# EAGLE schematic BMSafeMasterV2 (EAGLE 6.3)
DATABASE: ./BOM/BMSafeMasterV2-PARTSDB.txt

## Sheet 1 of 6: POWER SUPPLY
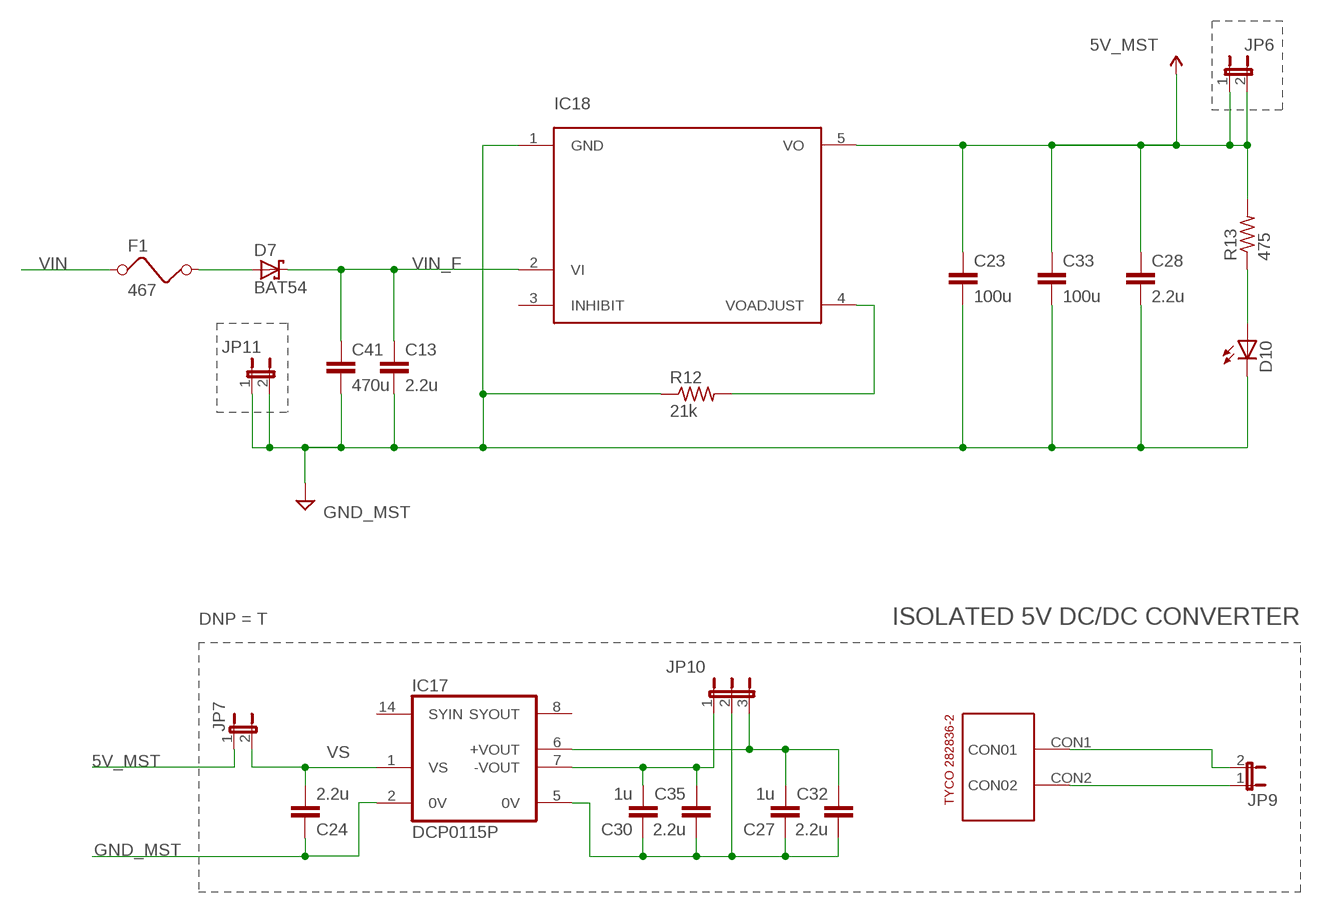
[diagram p0: schematic, sheet 1]

### Parts
C13  2.2u  C-EUC1210  [C1210]
C23  100u  P12924  [EEU-FM1E101]
C24  2.2u  C-EUC1210  [C1210]
C27  1u  C-EU050-024X044  [C050-024X044]
C28  2.2u  C-EUC1210  [C1210]
C30  1u  C-EU050-024X044  [C050-024X044]
C32  2.2u  C-EUC1210  [C1210]
C33  100u  P12924  [EEU-FM1E101]
C35  2.2u  C-EUC1210  [C1210]
C41  470u  P12924  [EEU-FM1E101]
D7  BAT54  [SOT23]
D10  LEDSMT1206  [1206]
F1  467  [0603]
IC17  DCP0115P  [DIL14/7]
IC18  DCDCMAITRE_HOLES  [DCDCMAITRE_HOLES]
JP6  JP1E  [JP1]
JP7  JP1E  [JP1]
JP9  JP1E  [JP1]
JP10  JP2E  [JP2]
JP11  JP1E  [JP1]
R12  21k  R-US_R0805  [R0805]
R13  475  R-US_R0805  [R0805]
X8  282836-2  [282836-2]

### Nets
5V_MST: C23.1 C28.1 C33.1 IC18.5(VO) JP6.1 JP6.2 JP7.1 R13.2 ; supply symbol labelled 5V ; also sheet 2,3,4,5,6
+5V_ISO: C27.2 C32.1 IC17.6(+VOUT) JP10.3
-5V_ISO: C30.2 C35.1 IC17.7(-VOUT) JP10.1
GND_MST: C13.2 C23.2 C24.1 C28.2 C33.2 C41.2 D10.C IC17.2(0V) IC18.1(GND) JP11.1 JP11.2 R12.1 ; supply symbol labelled GND ; also sheet 2,3,4,5,6
HV_GND: C27.1 C30.1 C32.2 C35.2 IC17.5(0V) JP10.2
N$8: D10.A R13.1
N$12: JP9.2 X8.CON1(CON01)
N$13: JP9.1 X8.CON2(CON02)
N$47: D7.1(A) F1.2
VIN: F1.1 ; also sheet 5
VIN_F: C13.1 C41.1 D7.3(C) IC18.2(VI)
VOADJUST: IC18.4(VOADJUST) R12.2
VS: C24.2 IC17.1(VS) JP7.2
Unconnected: IC17.8(SYOUT) IC17.14(SYIN) IC18.3(INHIBIT)

### Notes on the sheet
- IC18
- ISOLATED 5V DC/DC CONVERTER

## Sheet 2 of 6: MICROCONTROLLER
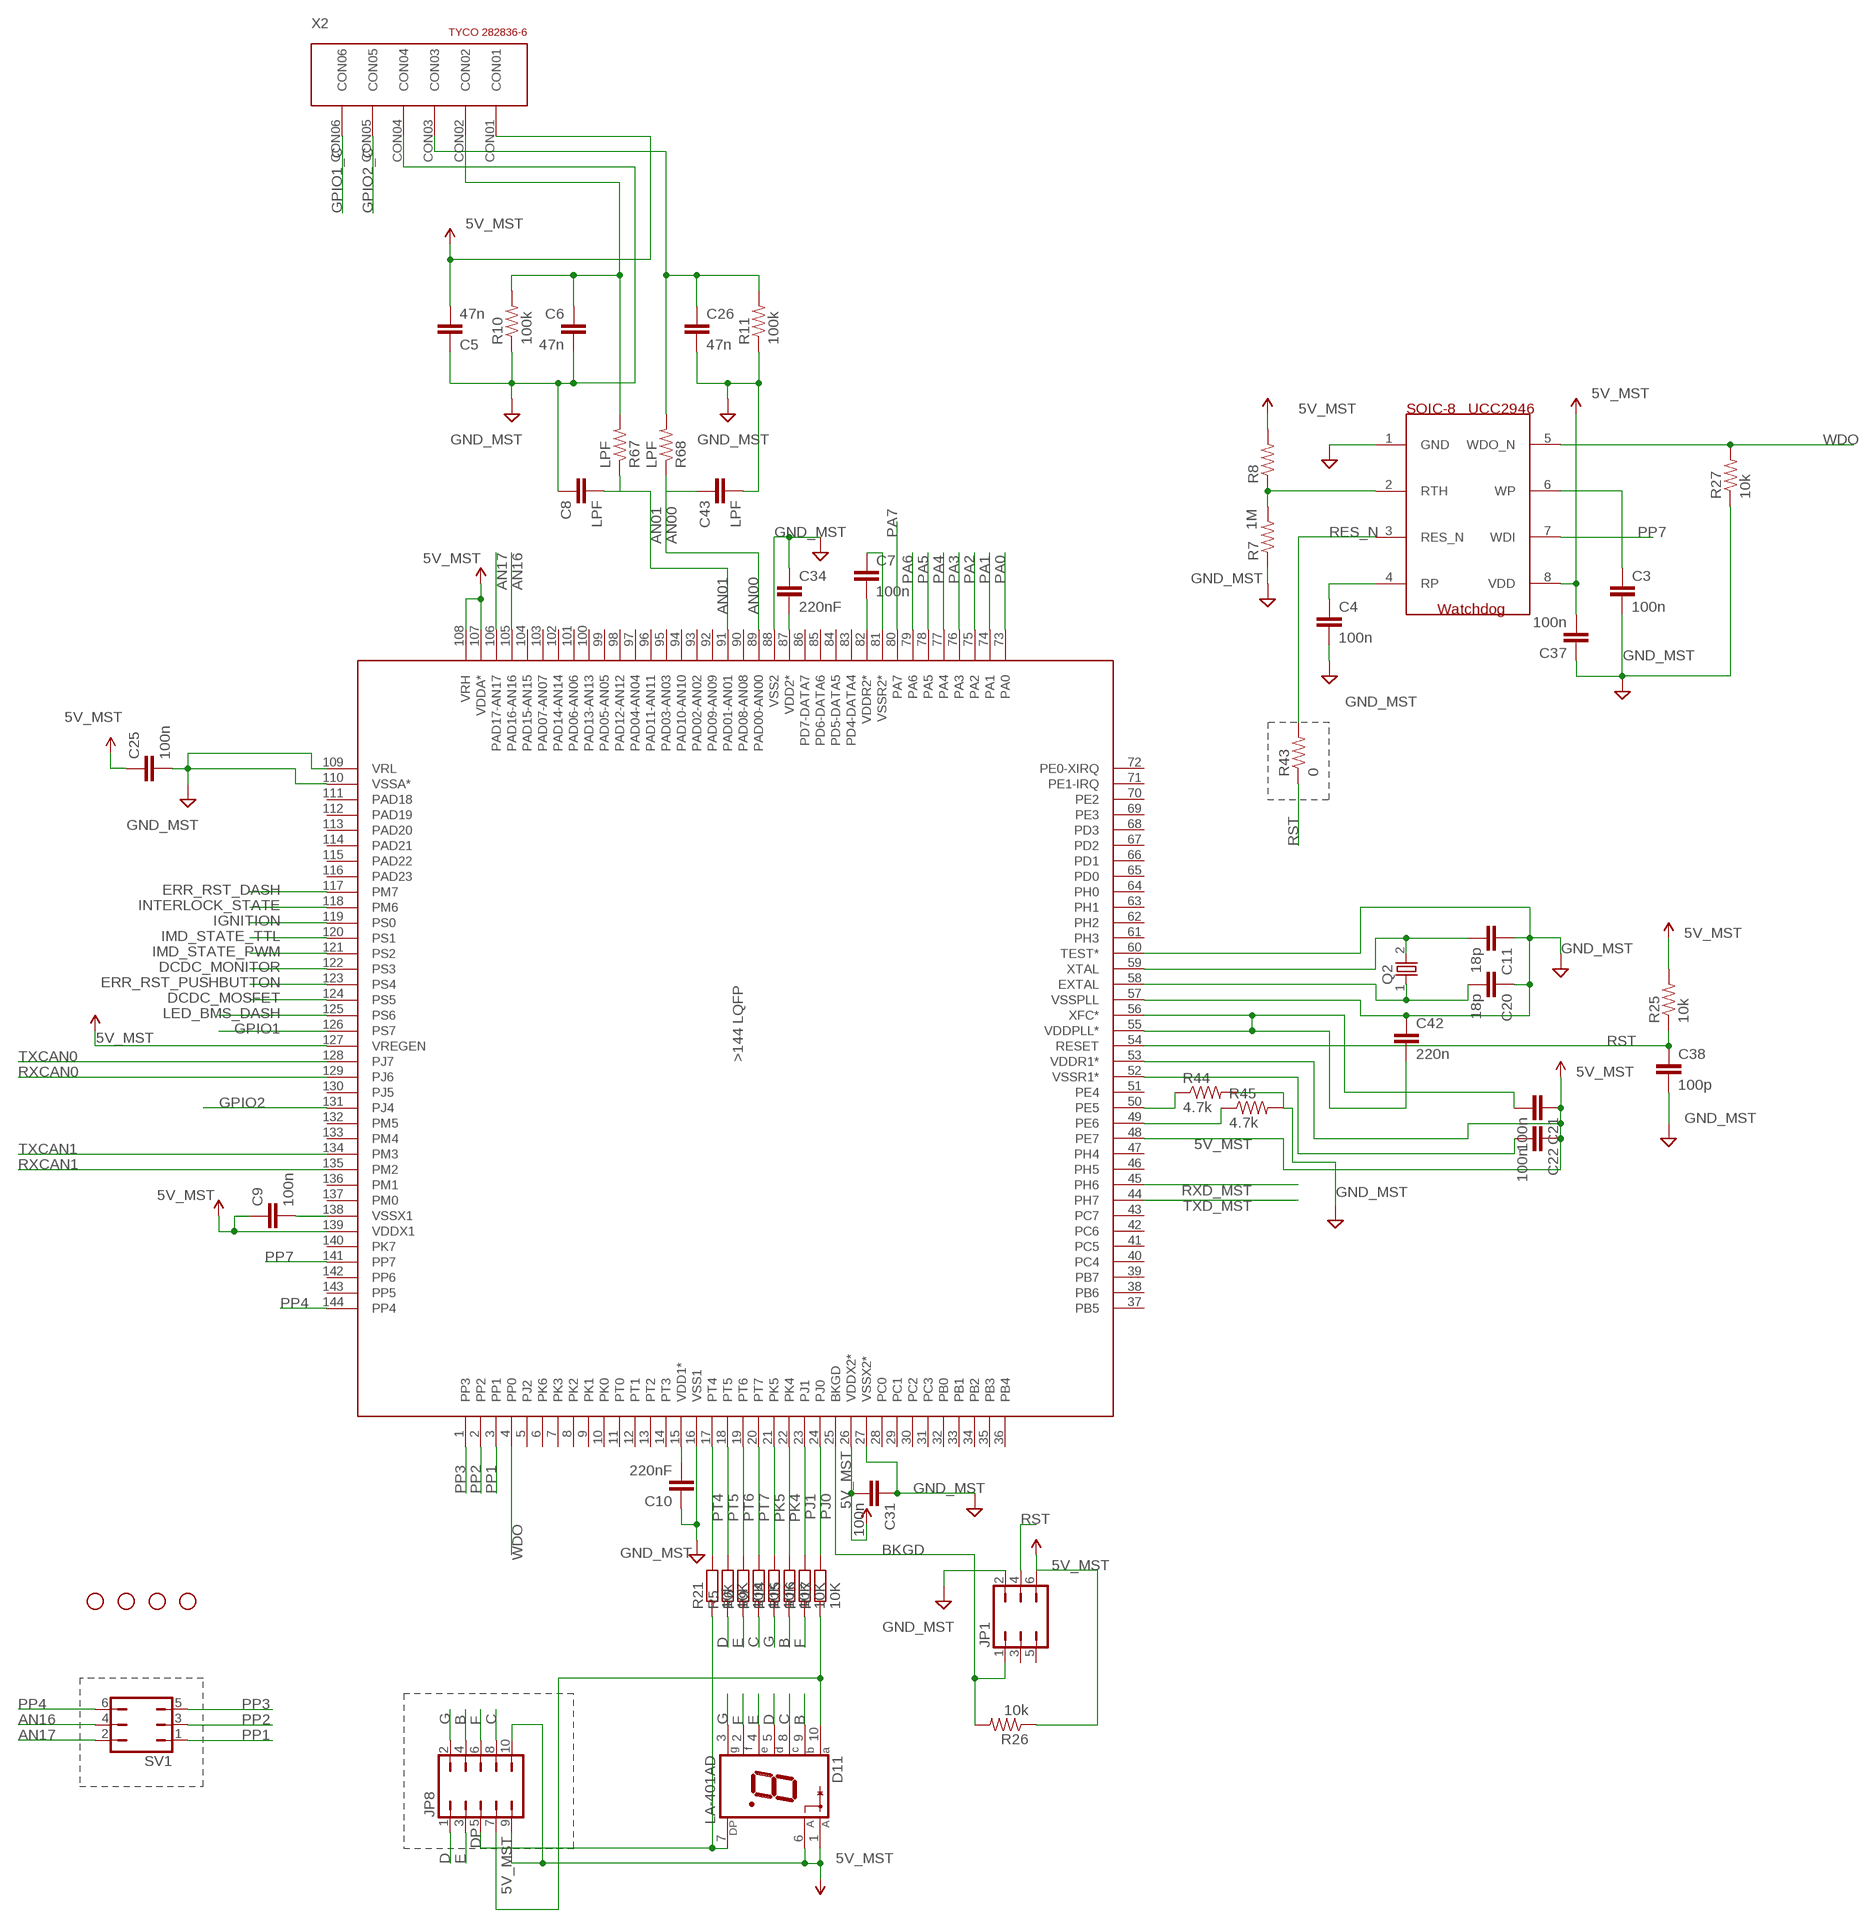
[diagram p1: schematic, sheet 2]

### Parts
C3  100n  C-EUC0805  [C0805]
C4  100n  C-EUC0805  [C0805]
C5  47n  C-EUC0805  [C0805]
C6  47n  C-EUC0805  [C0805]
C7  100n  C-EUC0805  [C0805]
C8  LPF  C-EUC0805  [C0805]
C9  100n  C-EUC0805  [C0805]
C10  220nF  C-EUC0805  [C0805]
C11  18p  C-EUC0805  [C0805]
C20  18p  C-EUC0805  [C0805]
C21  100n  C-EUC0805  [C0805]
C22  100n  C-EUC0805  [C0805]
C25  100n  C-EUC0805  [C0805]
C26  47n  C-EUC0805  [C0805]
C31  100n  C-EUC0805  [C0805]
C34  220nF  C-EUC0805  [C0805]
C37  100n  C-EUC0805  [C0805]
C38  100p  C-EUC0805  [C0805]
C42  220n  C-EUC0805  [C0805]
C43  LPF  C-EUC0805  [C0805]
D11  LA-401AD  [LA-401]
IC1  MC9S12XF-144  [SQFP-S-20X20-144]
IC14  WATCHDOG  [SOIC08]
JP1  JP3Q  [JP3Q]
JP2  STAND-OFF  [STAND-OFF]
JP3  STAND-OFF  [STAND-OFF]
JP4  STAND-OFF  [STAND-OFF]
JP5  STAND-OFF  [STAND-OFF]
JP8  JP5Q  [JP5Q]
Q2  CSM-7X  [CSM-7X]
R5  10K  R-EU_R0805  [R0805]
R6  10K  R-EU_R0805  [R0805]
R7  1M  R-US_R0805  [R0805]
R8  1M  R-US_R0805  [R0805]
R9  10K  R-EU_R0805  [R0805]
R10  100k  R-US_R0805  [R0805]
R11  100k  R-US_R0805  [R0805]
R14  10K  R-EU_R0805  [R0805]
R15  10K  R-EU_R0805  [R0805]
R16  10K  R-EU_R0805  [R0805]
R17  10K  R-EU_R0805  [R0805]
R21  10k  R-EU_R0805  [R0805]
R25  10k  R-US_R0805  [R0805]
R26  10k  R-US_R0805  [R0805]
R27  10k  R-US_R0805  [R0805]
R43  0  R-US_R0805  [R0805]
R44  4.7k  R-US_R0805  [R0805]
R45  4.7k  R-US_R0805  [R0805]
R67  LPF  R-US_R0805  [R0805]
R68  LPF  R-US_R0805  [R0805]
SV1  JP3Q  [JP3Q]
X2  282836-6  [282836-6]

### Nets
5V_MST: C5.2 C7.2 C9.1 C21.1 C22.1 C25.1 C31.2 C37.2 D11.1(A) D11.6(A) IC1.26(VDDX2*) IC1.48(PE7) IC1.53(VDDR1*) IC1.82(VDDR2*) IC1.107(VDDA*) IC1.108(VRH) IC1.127(VREGEN) IC1.139(VDDX1) IC14.8(VDD) JP1.6 JP8.9 JP8.10 R8.2 R25.2 R26.1 X2.CON01 ; supply symbol labelled 5V, 5V_mst ; also sheet 1,3,4,5,6
AN00: C43.1 IC1.89(PAD00-AN00) R68.1
AN00_C: C26.1 R11.2 R68.2 X2.CON03
AN01: C8.2 IC1.91(PAD01-AN01) R67.1
AN01_C: C6.1 R10.2 R67.2 X2.CON02
AN16: IC1.105(PAD16-AN16) SV1.4
AN17: IC1.106(PAD17-AN17) SV1.2
B: D11.9(B) JP8.4 R15.1
BKGD: IC1.25(BKGD) JP1.1 R26.2
C: D11.8(C) JP8.8 R9.1
D: D11.5(D) JP8.1 R5.1
DCDC_MONITOR: IC1.122(PS3) ; also sheet 4
DCDC_MOSFET: IC1.124(PS5) ; also sheet 4
DP: D11.7(DP) JP8.5 R21.1
E: D11.4(E) JP8.3 R6.1
ERR_RST_DASH: IC1.117(PM7) ; also sheet 4
ERR_RST_PUSHBUTTON: IC1.123(PS4) ; also sheet 4
EXTAL: C20.2 IC1.58(EXTAL) Q2.1
F: D11.2(F) JP8.6 R16.1
G: D11.3(G) JP8.2 R14.1
GND_MST: C3.2 C4.2 C5.1 C6.2 C7.1 C8.1 C9.2 C10.1 C11.1 C20.1 C22.2 C25.2 C26.2 C31.1 C34.1 C37.1 C38.2 C42.1 C43.2 IC1.16(VSS1) IC1.27(VSSX2*) IC1.52(VSSR1*) IC1.57(VSSPLL) IC1.60(TEST*) IC1.81(VSSR2*) IC1.88(VSS2) IC1.109(VRL) IC1.110(VSSA*) IC1.138(VSSX1) IC14.1(GND) JP1.2 R7.1 R10.1 R11.1 R27.1 R44.2 R45.2 X2.CON04 ; supply symbol labelled GND ; also sheet 1,3,4,5,6
GPIO1: IC1.126(PS7) ; also sheet 4
GPIO1_C: X2.CON06 ; also sheet 4
GPIO2: IC1.131(PJ4) ; also sheet 4
GPIO2_C: X2.CON05 ; also sheet 4
IGNITION: IC1.119(PS0) ; also sheet 4
IMD_STATE_PWM: IC1.121(PS2) ; also sheet 4
IMD_STATE_TTL: IC1.120(PS1) ; also sheet 4
INTERLOCK_STATE: IC1.118(PM6) ; also sheet 4
LED_BMS_DASH: IC1.125(PS6) ; also sheet 4
N$2: IC14.2(RTH) R7.2 R8.1
N$3: D11.10(A) JP8.7 R17.1
N$5: C4.1 IC14.4(RP)
N$7: C3.1 IC14.6(WP)
N$45: IC1.50(PE5) R44.1
N$46: IC1.49(PE6) R45.1
PA0: IC1.73(PA0) ; also sheet 5
PA1: IC1.74(PA1) ; also sheet 5
PA2: IC1.75(PA2) ; also sheet 5
PA3: IC1.76(PA3) ; also sheet 5
PA4: IC1.77(PA4) ; also sheet 5
PA5: IC1.78(PA5) ; also sheet 5
PA6: IC1.79(PA6)
PA7: IC1.80(PA7)
PJ0: IC1.24(PJ0) R17.2
PJ1: IC1.23(PJ1) R16.2
PK4: IC1.22(PK4) R15.2
PK5: IC1.21(PK5) R14.2
PP1: IC1.3(PP1) SV1.1
PP2: IC1.2(PP2) SV1.3
PP3: IC1.1(PP3) SV1.5
PP4: IC1.144(PP4) SV1.6
PP7: IC1.141(PP7) IC14.7(WDI)
PT4: IC1.17(PT4) R21.2
PT5: IC1.18(PT5) R5.2
PT6: IC1.19(PT6) R6.2
PT7: IC1.20(PT7) R9.2
RES_N: IC14.3(RES_N) R43.2
RST: C38.1 IC1.54(RESET) JP1.4 R25.1 R43.1
RXCAN0: IC1.129(PJ6) ; also sheet 3
RXCAN1: IC1.135(PM2) ; also sheet 3
RXD_MST: IC1.45(PH6) ; also sheet 6
TXCAN0: IC1.128(PJ7) ; also sheet 3
TXCAN1: IC1.134(PM3) ; also sheet 3
TXD_MST: IC1.44(PH7) ; also sheet 6
VDD: C34.2 IC1.87(VDD2*)
VDD1: C10.2 IC1.15(VDD1*)
VDDPLL: C21.2 C42.2 IC1.55(VDDPLL*) IC1.56(XFC*)
WDO: IC1.4(PP0) IC14.5(WDO_N) R27.2 ; also sheet 5
XTAL: C11.2 IC1.59(XTAL) Q2.2
Unconnected: IC1.5(PJ2) IC1.6(PK6) IC1.7(PK3) IC1.8(PK2) IC1.9(PK1) IC1.10(PK0) IC1.11(PT0) IC1.12(PT1) IC1.13(PT2) IC1.14(PT3) IC1.28(PC0) IC1.29(PC1) IC1.30(PC2) IC1.31(PC3) IC1.32(PB0) IC1.33(PB1) IC1.34(PB2) IC1.35(PB3) IC1.36(PB4) IC1.37(PB5) IC1.38(PB6) IC1.39(PB7) IC1.40(PC4) IC1.41(PC5) IC1.42(PC6) IC1.43(PC7) IC1.46(PH5) IC1.47(PH4) IC1.51(PE4) IC1.61(PH3) IC1.62(PH2) IC1.63(PH1) IC1.64(PH0) IC1.65(PD0) IC1.66(PD1) IC1.67(PD2) IC1.68(PD3) IC1.69(PE3) IC1.70(PE2) IC1.71(PE1-IRQ) IC1.72(PE0-XIRQ) IC1.83(PD4-DATA4) IC1.84(PD5-DATA5) IC1.85(PD6-DATA6) IC1.86(PD7-DATA7) IC1.90(PAD08-AN08) IC1.92(PAD09-AN09) IC1.93(PAD02-AN02) IC1.94(PAD10-AN10) IC1.95(PAD03-AN03) IC1.96(PAD11-AN11) IC1.97(PAD04-AN04) IC1.98(PAD12-AN12) IC1.99(PAD05-AN05) IC1.100(PAD13-AN13) IC1.101(PAD06-AN06) IC1.102(PAD14-AN14) IC1.103(PAD07-AN07) IC1.104(PAD15-AN15) IC1.111(PAD18) IC1.112(PAD19) IC1.113(PAD20) IC1.114(PAD21) IC1.115(PAD22) IC1.116(PAD23) IC1.130(PJ5) IC1.132(PM5) IC1.133(PM4) IC1.136(PM1) IC1.137(PM0) IC1.140(PK7) IC1.142(PP6) IC1.143(PP5) JP1.3 JP1.5

### Notes on the sheet
- X2

## Sheet 3 of 6: CAN
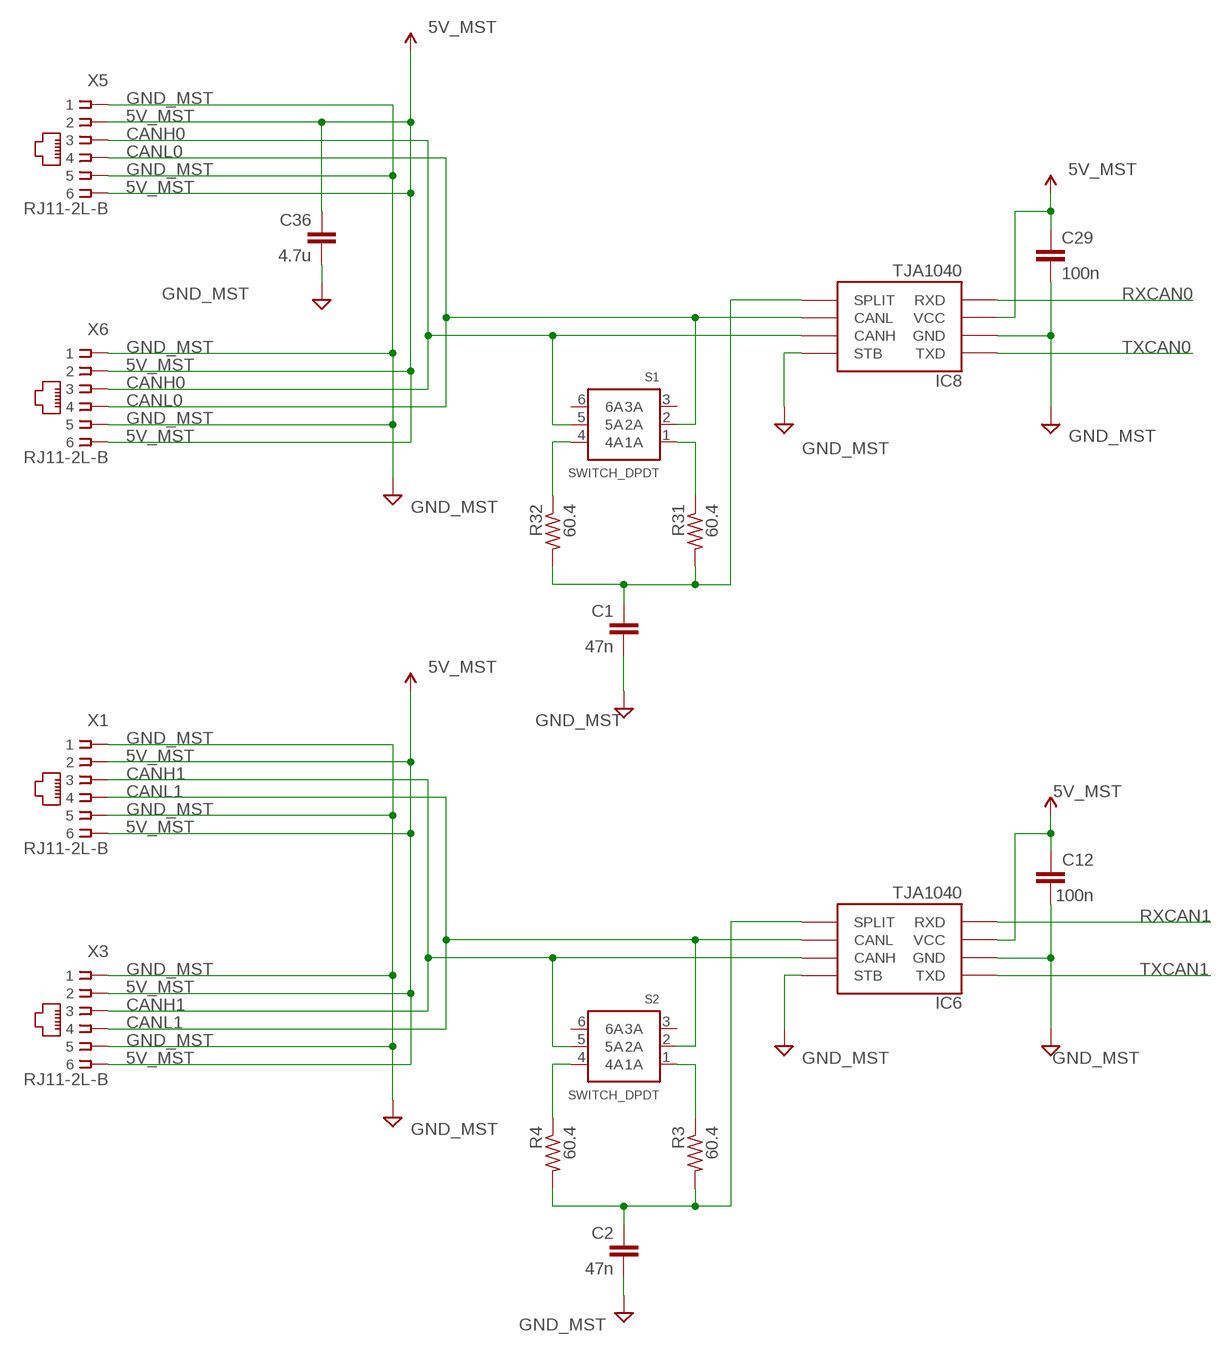
[diagram p2: schematic, sheet 3]

### Parts
C1  47n  C-EUC0805  [C0805]
C2  47n  C-EUC0805  [C0805]
C12  100n  C-EUC0805  [C0805]
C29  100n  C-EUC0805  [C0805]
C36  4.7u  C-EUC1206  [C1206]
IC6  TJA1040  [SO8]
IC8  TJA1040  [SO8]
R3  60.4  R-US_R1206  [R1206]
R4  60.4  R-US_R1206  [R1206]
R31  60.4  R-US_R1206  [R1206]
R32  60.4  R-US_R1206  [R1206]
S1  SWITCH_DPDT  [DPDT]
S2  SWITCH_DPDT  [DPDT]
X1  RJ11-2L-B  [RJ11-NO_SHIELD]
X3  RJ11-2L-B  [RJ11-NO_SHIELD]
X5  RJ11-2L-B  [RJ11-NO_SHIELD]
X6  RJ11-2L-B  [RJ11-NO_SHIELD]

### Nets
5V_MST: C12.1 C29.1 C36.1 IC6.3(VCC) IC8.3(VCC) X1.2 X1.6 X3.2 X3.6 X5.2 X5.6 X6.2 X6.6 ; supply symbol labelled 5V ; also sheet 1,2,4,5,6
CANH0: IC8.7(CANH) S1.5(5A) X5.3 X6.3
CANH1: IC6.7(CANH) S2.5(5A) X1.3 X3.3
CANL0: IC8.6(CANL) S1.2(2A) X5.4 X6.4
CANL1: IC6.6(CANL) S2.2(2A) X1.4 X3.4
GND_MST: C1.2 C2.2 C12.2 C29.2 C36.2 IC6.2(GND) IC6.8(STB) IC8.2(GND) IC8.8(STB) X1.1 X1.5 X3.1 X3.5 X5.1 X5.5 X6.1 X6.5 ; supply symbol labelled GND ; also sheet 1,2,4,5,6
N$18: C2.1 IC6.5(SPLIT) R3.2 R4.2
N$19: R3.1 S2.1(1A)
N$20: R4.1 S2.4(4A)
N$29: C1.1 IC8.5(SPLIT) R31.2 R32.2
N$34: R31.1 S1.1(1A)
N$37: R32.1 S1.4(4A)
RXCAN0: IC8.4(RXD) ; also sheet 2
RXCAN1: IC6.4(RXD) ; also sheet 2
TXCAN0: IC8.1(TXD) ; also sheet 2
TXCAN1: IC6.1(TXD) ; also sheet 2
Unconnected: S1.3(3A) S1.6(6A) S2.3(3A) S2.6(6A)

## Sheet 4 of 6: I/O
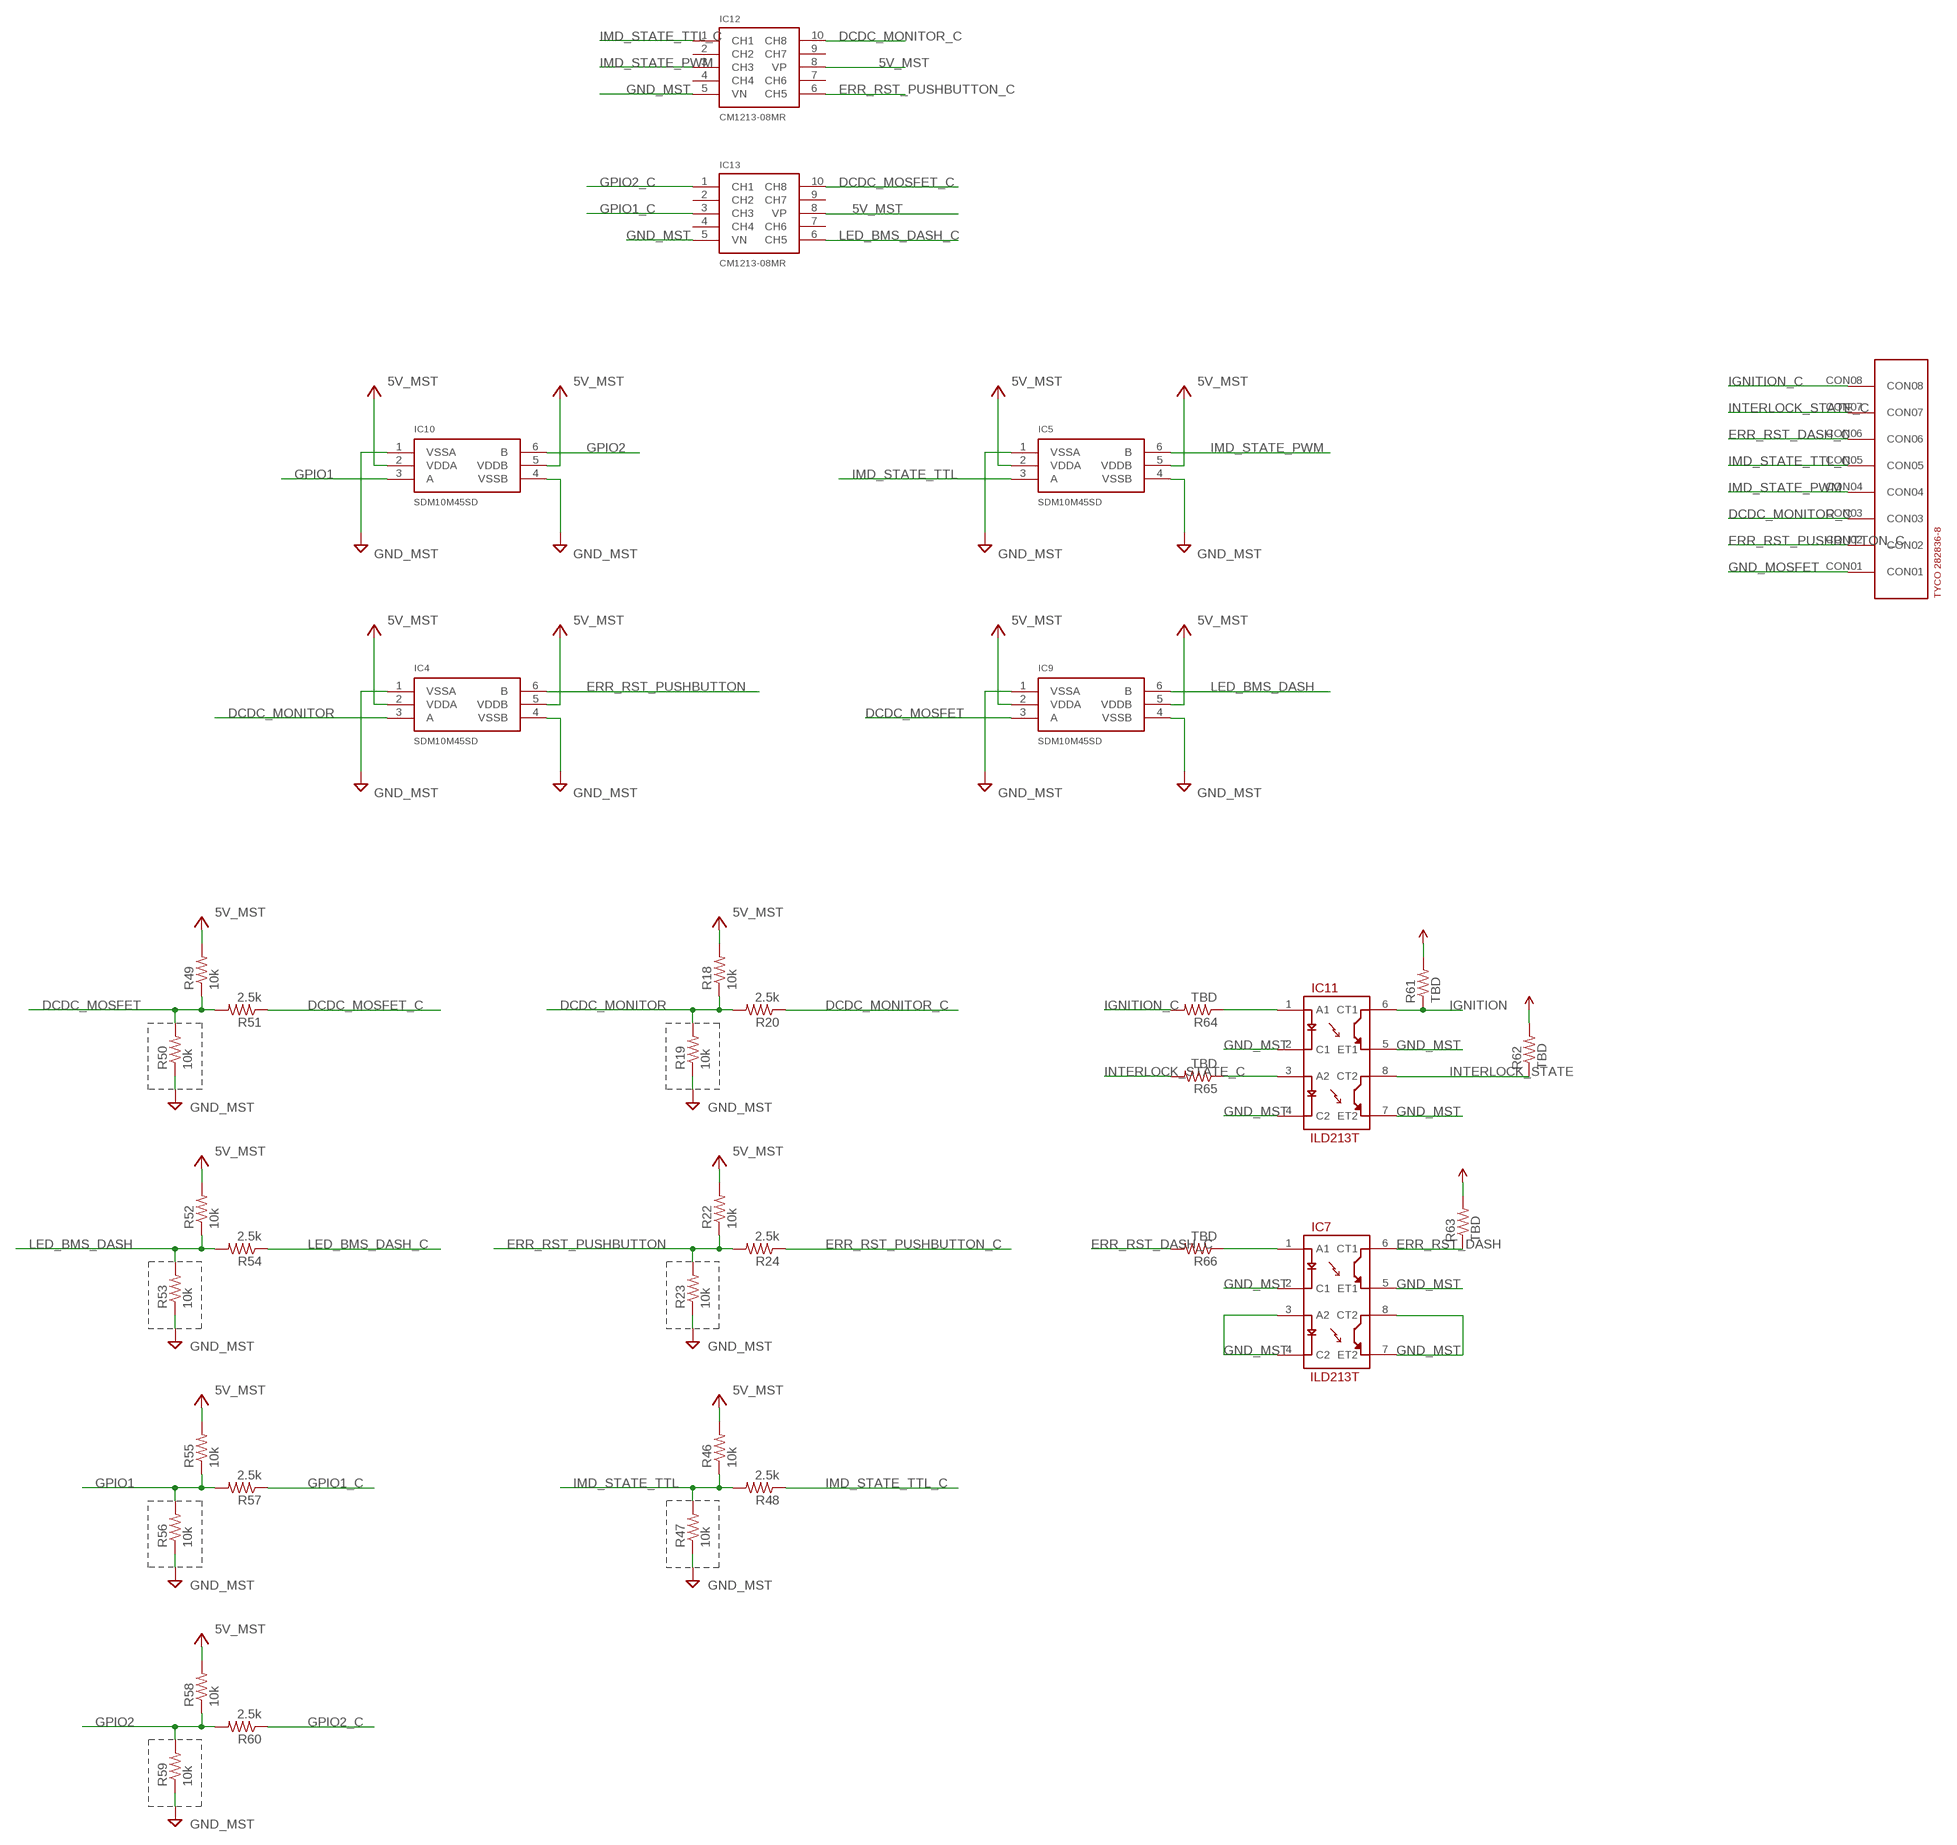
[diagram p3: schematic, sheet 4]

### Parts
IC4  SDM10M45SD  [SOT-26]
IC5  SDM10M45SD  [SOT-26]
IC7  ILD213T  [SO08]
IC9  SDM10M45SD  [SOT-26]
IC10  SDM10M45SD  [SOT-26]
IC11  ILD213T  [SO08]
IC12  CM1213-08MR  [MSOP10]
IC13  CM1213-08MR  [MSOP10]
R18  10k  R-US_R0805  [R0805]
R19  10k  R-US_R0805  [R0805]
R20  2.5k  R-US_R0805  [R0805]
R22  10k  R-US_R0805  [R0805]
R23  10k  R-US_R0805  [R0805]
R24  2.5k  R-US_R0805  [R0805]
R46  10k  R-US_R0805  [R0805]
R47  10k  R-US_R0805  [R0805]
R48  2.5k  R-US_R0805  [R0805]
R49  10k  R-US_R0805  [R0805]
R50  10k  R-US_R0805  [R0805]
R51  2.5k  R-US_R0805  [R0805]
R52  10k  R-US_R0805  [R0805]
R53  10k  R-US_R0805  [R0805]
R54  2.5k  R-US_R0805  [R0805]
R55  10k  R-US_R0805  [R0805]
R56  10k  R-US_R0805  [R0805]
R57  2.5k  R-US_R0805  [R0805]
R58  10k  R-US_R0805  [R0805]
R59  10k  R-US_R0805  [R0805]
R60  2.5k  R-US_R0805  [R0805]
R61  TBD  R-US_R0805  [R0805]
R62  TBD  R-US_R0805  [R0805]
R63  TBD  R-US_R0805  [R0805]
R64  TBD  R-US_R0805  [R0805]
R65  TBD  R-US_R0805  [R0805]
R66  TBD  R-US_R0805  [R0805]
X9  282836-8  [282836-8]

### Nets
5V_MST: IC4.2(VDDA) IC4.5(VDDB) IC5.2(VDDA) IC5.5(VDDB) IC9.2(VDDA) IC9.5(VDDB) IC10.2(VDDA) IC10.5(VDDB) IC12.8(VP) IC13.8(VP) R18.2 R22.2 R46.2 R49.2 R52.2 R55.2 R58.2 R61.2 R62.2 R63.2 ; supply symbol labelled V+, 5V ; also sheet 1,2,3,5,6
DCDC_MONITOR: IC4.3(A) R18.1 R19.2 R20.2 ; also sheet 2
DCDC_MONITOR_C: IC12.10(CH8) R20.1 X9.CON03
DCDC_MOSFET: IC9.3(A) R49.1 R50.2 R51.2 ; also sheet 2
DCDC_MOSFET_C: IC13.10(CH8) R51.1 ; also sheet 5
ERR_RST_DASH: IC7.6(CT1) R63.1 ; also sheet 2
ERR_RST_DASH_C: R66.2 X9.CON06
ERR_RST_PUSHBUTTON: IC4.6(B) R22.1 R23.2 R24.2 ; also sheet 2
ERR_RST_PUSHBUTTON_C: IC12.6(CH5) R24.1 X9.CON02
GND_MOSFET: X9.CON01 ; also sheet 5
GND_MST: IC4.1(VSSA) IC4.4(VSSB) IC5.1(VSSA) IC5.4(VSSB) IC7.2(C1) IC7.3(A2) IC7.4(C2) IC7.5(ET1) IC7.7(ET2) IC7.8(CT2) IC9.1(VSSA) IC9.4(VSSB) IC10.1(VSSA) IC10.4(VSSB) IC11.2(C1) IC11.4(C2) IC11.5(ET1) IC11.7(ET2) IC12.5(VN) IC13.5(VN) R19.1 R23.1 R47.1 R50.1 R53.1 R56.1 R59.1 ; supply symbol labelled DGND ; also sheet 1,2,3,5,6
GPIO1: IC10.3(A) R55.1 R56.2 R57.2 ; also sheet 2
GPIO1_C: IC13.3(CH3) R57.1 ; also sheet 2
GPIO2: IC10.6(B) R58.1 R59.2 R60.2 ; also sheet 2
GPIO2_C: IC13.1(CH1) R60.1 ; also sheet 2
IGNITION: IC11.6(CT1) R61.1 ; also sheet 2
IGNITION_C: R64.2 X9.CON08
IMD_STATE_PWM: IC5.6(B) IC12.3(CH3) X9.CON04 ; also sheet 2
IMD_STATE_TTL: IC5.3(A) R46.1 R47.2 R48.2 ; also sheet 2
IMD_STATE_TTL_C: IC12.1(CH1) R48.1 X9.CON05
INTERLOCK_STATE: IC11.8(CT2) R62.1 ; also sheet 2
INTERLOCK_STATE_C: R65.2 X9.CON07
LED_BMS_DASH: IC9.6(B) R52.1 R53.2 R54.2 ; also sheet 2
LED_BMS_DASH_C: IC13.6(CH5) R54.1 ; also sheet 5
N$6: IC11.1(A1) R64.1
N$9: IC11.3(A2) R65.1
N$49: IC7.1(A1) R66.1
Unconnected: IC12.2(CH2) IC12.4(CH4) IC12.7(CH6) IC12.9(CH7) IC13.2(CH2) IC13.4(CH4) IC13.7(CH6) IC13.9(CH7)

## Sheet 5 of 6: RELAYS CONTROL
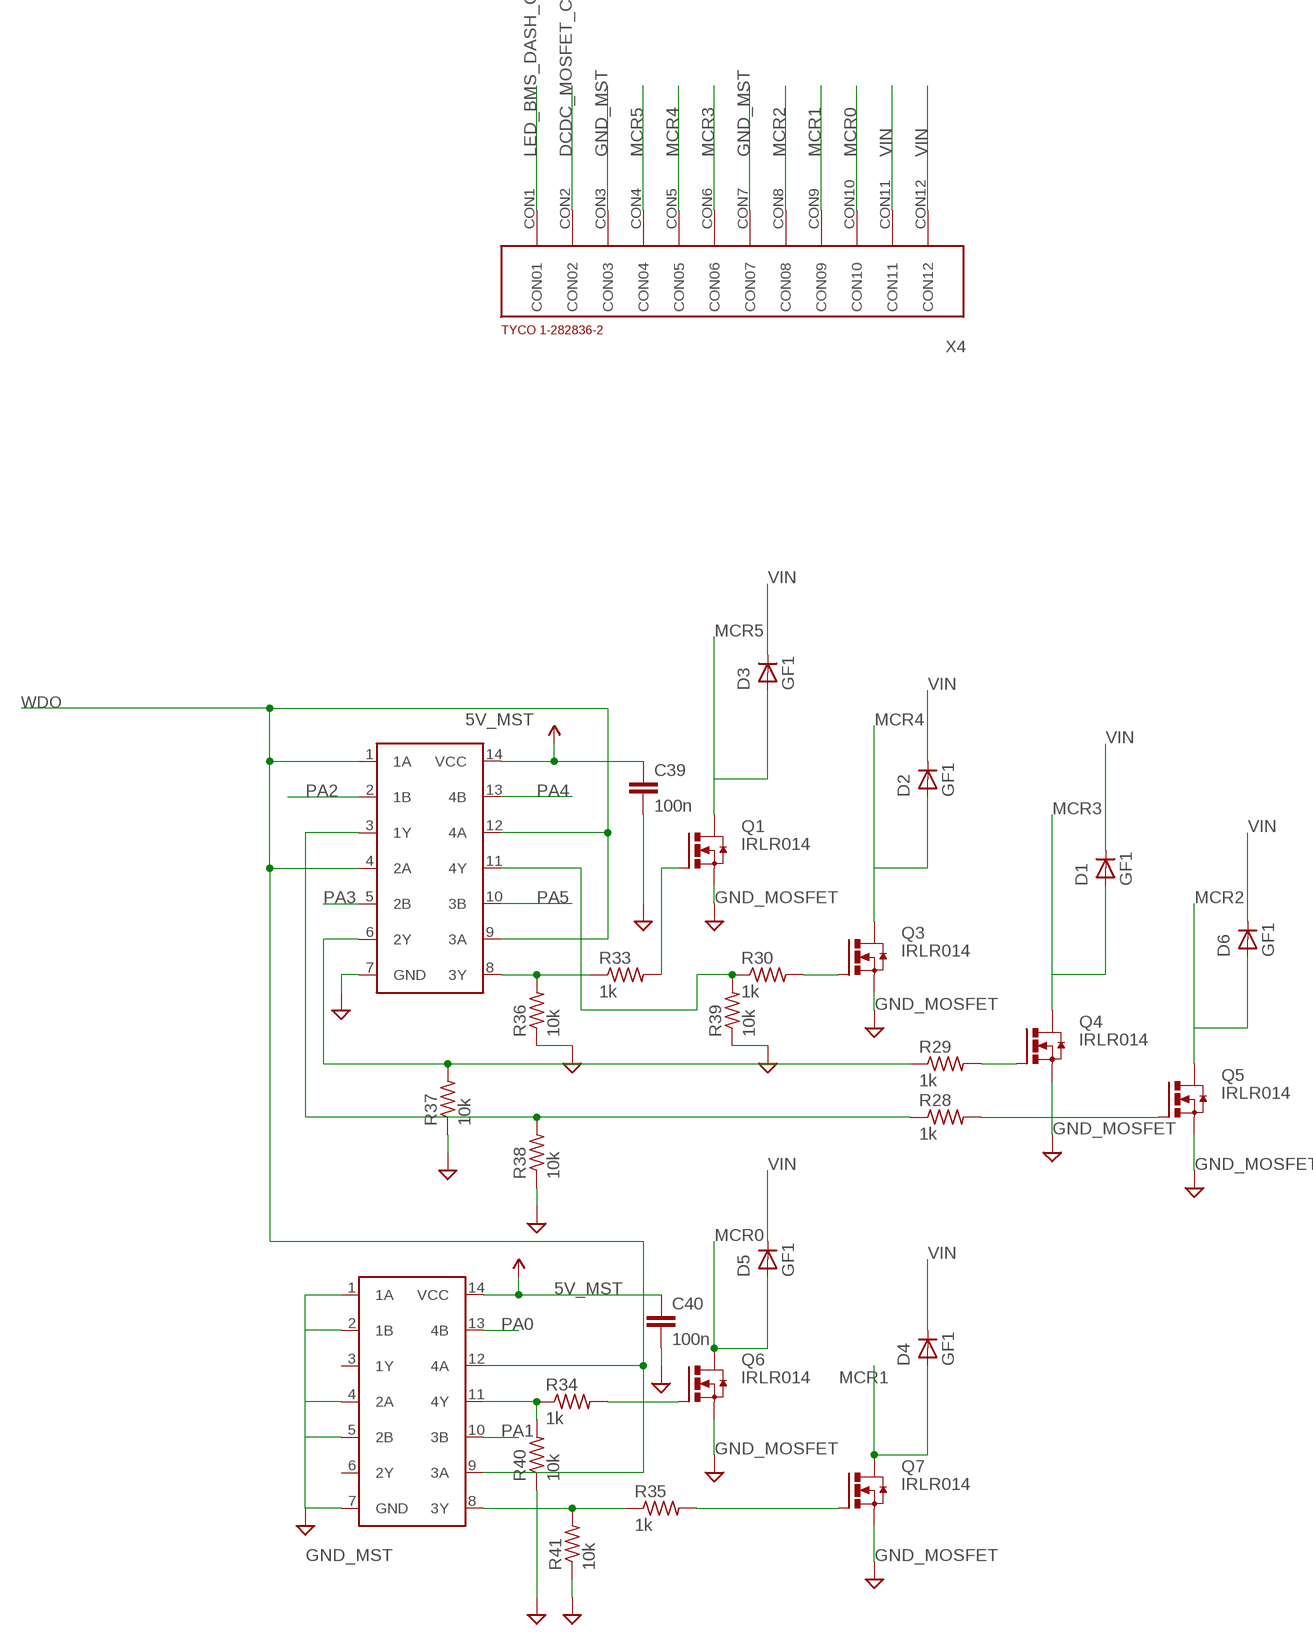
[diagram p4: schematic, sheet 5]

### Parts
C39  100n  C-EUC0805  [C0805]
C40  100n  C-EUC0805  [C0805]
D1  GF1  [SMA-DO214AC]
D2  GF1  [SMA-DO214AC]
D3  GF1  [SMA-DO214AC]
D4  GF1  [SMA-DO214AC]
D5  GF1  [SMA-DO214AC]
D6  GF1  [SMA-DO214AC]
IC15  SN74HC08  [TSSOP14]
IC16  SN74HC08  [TSSOP14]
Q1  IRLR014  [TO-252]
Q3  IRLR014  [TO-252]
Q4  IRLR014  [TO-252]
Q5  IRLR014  [TO-252]
Q6  IRLR014  [TO-252]
Q7  IRLR014  [TO-252]
R28  1k  R-US_R0805  [R0805]
R29  1k  R-US_R0805  [R0805]
R30  1k  R-US_R0805  [R0805]
R33  1k  R-US_R0805  [R0805]
R34  1k  R-US_R0805  [R0805]
R35  1k  R-US_R0805  [R0805]
R36  10k  R-US_R0805  [R0805]
R37  10k  R-US_R0805  [R0805]
R38  10k  R-US_R0805  [R0805]
R39  10k  R-US_R0805  [R0805]
R40  10k  R-US_R0805  [R0805]
R41  10k  R-US_R0805  [R0805]
X4  1-282836-2  [1-282836-2]

### Nets
5V_MST: C39.1 C40.1 IC15.14(VCC) IC16.14(VCC) ; supply symbol labelled 5V ; also sheet 1,2,3,4,6
DCDC_MOSFET_C: X4.CON2(CON02) ; also sheet 4
GM2: IC15.3(1Y) R28.1 R38.2
GM3: IC15.6(2Y) R29.1 R37.2
GND_MOSFET: Q1.P$3(S) Q3.P$3(S) Q4.P$3(S) Q5.P$3(S) Q6.P$3(S) Q7.P$3(S) ; supply symbol labelled GND ; also sheet 4
GND_MST: C39.2 C40.2 IC15.7(GND) IC16.1(1A) IC16.2(1B) IC16.4(2A) IC16.5(2B) IC16.7(GND) R36.1 R37.1 R38.1 R39.1 R40.1 R41.1 X4.CON3(CON03) X4.CON7(CON07) ; supply symbol labelled GND ; also sheet 1,2,3,4,6
LED_BMS_DASH_C: X4.CON1(CON01) ; also sheet 4
MCR0: D5.A Q6.P$4(D) X4.CON10
MCR1: D4.A Q7.P$4(D) X4.CON9(CON09)
MCR2: D6.A Q5.P$4(D) X4.CON8(CON08)
MCR3: D1.A Q4.P$4(D) X4.CON6(CON06)
MCR4: D2.A Q3.P$4(D) X4.CON5(CON05)
MCR5: D3.A Q1.P$4(D) X4.CON4(CON04)
N$10: IC16.11(4Y) R34.1 R40.2
N$11: Q6.P$1(G) R34.2
N$14: IC16.8(3Y) R35.1 R41.2
N$15: Q7.P$1(G) R35.2
N$17: Q1.P$1(G) R33.2
N$28: IC15.8(3Y) R33.1 R36.2
N$30: IC15.11(4Y) R30.1 R39.2
N$32: Q3.P$1(G) R30.2
N$42: Q4.P$1(G) R29.2
N$43: Q5.P$1(G) R28.2
PA0: IC16.13(4B) ; also sheet 2
PA1: IC16.10(3B) ; also sheet 2
PA2: IC15.2(1B) ; also sheet 2
PA3: IC15.5(2B) ; also sheet 2
PA4: IC15.13(4B) ; also sheet 2
PA5: IC15.10(3B) ; also sheet 2
VIN: D1.K(C) D2.K(C) D3.K(C) D4.K(C) D5.K(C) D6.K(C) X4.CON11 X4.CON12 ; also sheet 1
WDO: IC15.1(1A) IC15.4(2A) IC15.9(3A) IC15.12(4A) IC16.9(3A) IC16.12(4A) ; also sheet 2
Unconnected: IC16.3(1Y) IC16.6(2Y)

### Notes on the sheet
- X4

## Sheet 6 of 6: USB INTERFACE
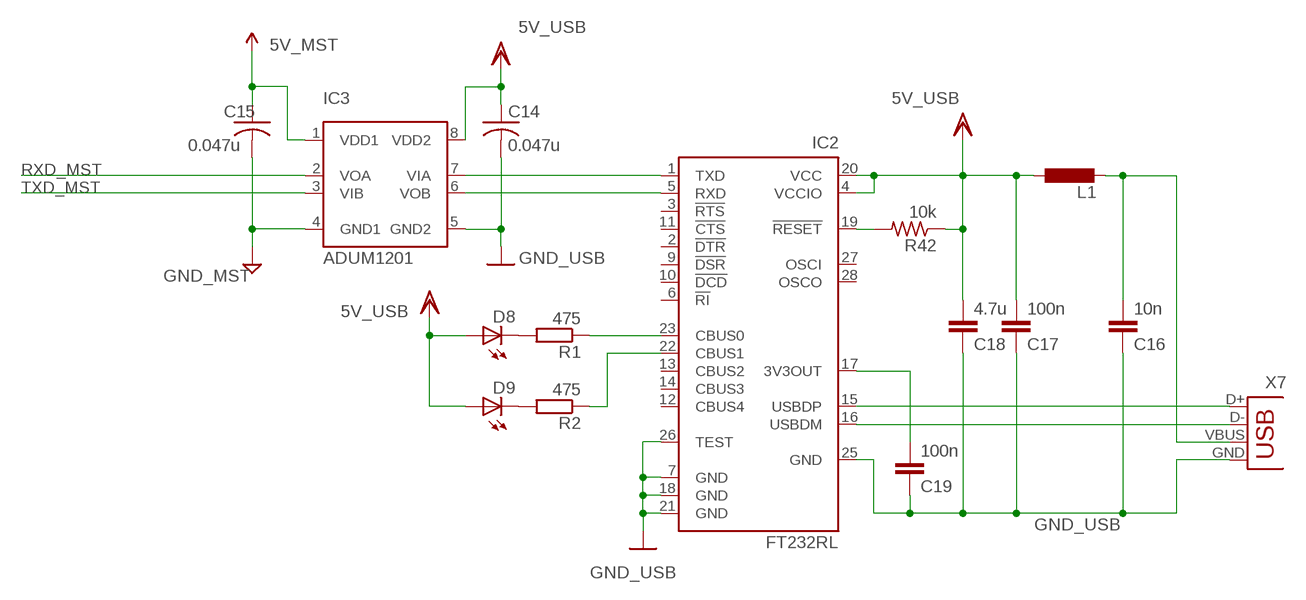
[diagram p5: schematic, sheet 6]

### Parts
C14  0.047u  C-USC0805  [C0805]
C15  0.047u  C-USC0805  [C0805]
C16  10n  C-EUC0805  [C0805]
C17  100n  C-EUC0805  [C0805]
C18  4.7u  C-EUC1206  [C1206]
C19  100n  C-EUC0805  [C0805]
D8  LEDSMT1206  [1206]
D9  LEDSMT1206  [1206]
IC2  FT232RL  [SSOP28]
IC3  ADUM1201  [SOIC]
L1  MYDEVICE  [C0805]
R1  475  R-EU_R0805  [R0805]
R2  475  R-EU_R0805  [R0805]
R42  10k  R-US_R0805  [R0805]
X7  USBPTH  [USB-B-PTH]

### Nets
5V_MST: C15.1 IC3.1(VDD1) ; supply symbol labelled 5V ; also sheet 1,2,3,4,5
5V_USB: C14.1 C17.2 C18.2 D8.A D9.A IC2.4(VCCIO) IC2.20(VCC) IC3.8(VDD2) L1.1 R42.1 ; supply symbol labelled VDD
GND_MST: C15.2 IC3.4(GND1) ; supply symbol labelled GND ; also sheet 1,2,3,4,5
GND_USB: C14.2 C16.1 C17.1 C18.1 C19.1 IC2.7(GND) IC2.18(GND) IC2.21(GND) IC2.25(GND) IC2.26(TEST) IC3.5(GND2) X7.GND ; supply symbol labelled 0V
N$21: IC2.15(USBDP) X7.D+
N$22: IC2.16(USBDM) X7.D-
N$23: IC2.23(CBUS0) R1.1
N$24: D8.C R1.2
N$25: IC2.22(CBUS1) R2.1
N$26: D9.C R2.2
N$27: C19.2 IC2.17(3V3OUT)
N$44: IC2.19(!RESET) R42.2
RXD_MST: IC3.2(VOA) ; also sheet 2
RXD_USB: IC2.5(RXD) IC3.6(VOB)
TXD_MST: IC3.3(VIB) ; also sheet 2
TXD_USB: IC2.1(TXD) IC3.7(VIA)
VUSB: C16.2 L1.2 X7.VBUS
Unconnected: IC2.2(!DTR) IC2.3(!RTS) IC2.6(!RI) IC2.9(!DSR) IC2.10(!DCD) IC2.11(!CTS) IC2.12(CBUS4) IC2.13(CBUS2) IC2.14(CBUS3) IC2.27(OSCI) IC2.28(OSCO)

### Notes on the sheet
- X7

## Library data of the parts
C1 C2 C5 C6 C26 = rcl:C-EU: CAPACITOR, European symbol; PARTNO: 08055C473KAT2A
C3 C4 C7 C9 C12 C17 C19 C21 C22 C25 C29 C31 C37 C39 C40 = rcl:C-EU: CAPACITOR, European symbol; PARTNO: 08055C104KAT2A
C8 C43 = rcl:C-EU: CAPACITOR, European symbol
C10 C34 C42 = rcl:C-EU: CAPACITOR, European symbol; PARTNO: C2012X7R1H224K125AA
C11 C20 = rcl:C-EU: CAPACITOR, European symbol; PARTNO: 08055A180JAT2A
C13 C28 = rcl:C-EU: CAPACITOR, European symbol; PARTNO: C3225X7R1H225K250AB
C14 C15 = rcl:C-US: CAPACITOR, American symbol; PARTNO: 08055C473KAT2A
C16 = rcl:C-EU: CAPACITOR, European symbol; PARTNO: 08055C103KAT2A
C18 C36 = rcl:C-EU: CAPACITOR, European symbol; PARTNO: C3216X5R1A475K
C23 C33 = elc_n:P12924; PARTNO: EEU-FM1E101
C24 C32 C35 = rcl:C-EU: CAPACITOR, European symbol; DNP: T; PARTNO: C3225X7R1H225K250AB
C27 C30 = rcl:C-EU: CAPACITOR, European symbol; DNP: T; PARTNO: TAP105M035SCS
C38 = rcl:C-EU: CAPACITOR, European symbol; PARTNO: C0805C101J5GACTU
C41 = elc_n:P12924
D1-D6 = diode:GF1: DIODE
D7 = diode:BAT54: Schottky Diodes Source: Fairchild .. BAT54.pdf; PARTNO: BAT750TA
D8 D9 = led:LED: LED OSRAM: - CHIPLED LG R971, LG N971, LY N971, LG Q971, LY Q971, LO R971, LY R971 LH N974, LH R974 LS Q976, LO Q976, LY Q976 LO Q996 - Hyper CHIPLED LW Q18S LB Q993, LB Q99A, LB R99A - SideLED LS A670, LO A670, LY A670, LG A670, LP A670 LB A673, LV A673, LT A673, LW A673 LH A674 LY A675 LS A676, LA A676, LO A676, LY A676, LW A676 LS A679, LY A679, LG A679 - Hyper Micro SIDELED® LS Y876, LA Y876, LO Y876, LY Y876 LT Y87S - SmartLED LW L88C, LW L88S LB L89C, LB L89S, LG L890 LS L89K, LO L89K, LY L89K LS L896, LA L896, LO L896, LY L896 - TOPLED LS T670, LO T670, LY T670, LG T670, LP T670 LSG T670, LSP T670, LSY T670, LOP T670, LYG T670 LG T671, LOG T671, LSG T671 LB T673, LV T673, LT T673, LW T673 LH T674 LS T676, LA T676, LO T676, LY T676, LB T676, LH T676, LSB T676, LW T676 LB T67C, LV T67C, LT T67C, LS T67K, LO T67K, LY T67K, LW E67C LS E67B, LA E67B, LO E67B, LY E67B, LB E67C, LV E67C, LT E67C LW T67C LS T679, LY T679, LG T679 LS T770, LO T770, LY T770, LG T770, LP T770 LB T773, LV T773, LT T773, LW T773 LH T774 LS E675, LA E675, LY E675, LS T675 LS T776, LA T776, LO T776, LY T776, LB T776 LHGB T686 LT T68C, LB T68C - Hyper Mini TOPLED® LB M676 - Mini TOPLED Santana® LG M470 LS M47K, LO M47K, LY M47K Source: http://www.osram.convergy.de LUXEON: - LUMILED® LXK2-PW12-R00, LXK2-PW12-S00, LXK2-PW14-U00, LXK2-PW14-V00 LXK2-PM12-R00, LXK2-PM12-S00, LXK2-PM14-U00 LXK2-PE12-Q00, LXK2-PE12-R00, LXK2-PE12-S00, LXK2-PE14-T00, LXK2-PE14-U00 LXK2-PB12-K00, LXK2-PB12-L00, LXK2-PB12-M00, LXK2-PB14-N00, LXK2-PB14-P00, LXK2-PB14-Q00 LXK2-PR12-L00, LXK2-PR12-M00, LXK2-PR14-Q00, LXK2-PR14-R00 LXK2-PD12-Q00, LXK2-PD12-R00, LXK2-PD12-S00 LXK2-PH12-R00, LXK2-PH12-S00 LXK2-PL12-P00, LXK2-PL12-Q00, LXK2-PL12-R00 Source: www.luxeon.com KINGBRIGHT: KA-3528ASYC Source: www.kingbright.com; PARTNO: LTST-C150KSKT
D10 = led:LED: LED OSRAM: - CHIPLED LG R971, LG N971, LY N971, LG Q971, LY Q971, LO R971, LY R971 LH N974, LH R974 LS Q976, LO Q976, LY Q976 LO Q996 - Hyper CHIPLED LW Q18S LB Q993, LB Q99A, LB R99A - SideLED LS A670, LO A670, LY A670, LG A670, LP A670 LB A673, LV A673, LT A673, LW A673 LH A674 LY A675 LS A676, LA A676, LO A676, LY A676, LW A676 LS A679, LY A679, LG A679 - Hyper Micro SIDELED® LS Y876, LA Y876, LO Y876, LY Y876 LT Y87S - SmartLED LW L88C, LW L88S LB L89C, LB L89S, LG L890 LS L89K, LO L89K, LY L89K LS L896, LA L896, LO L896, LY L896 - TOPLED LS T670, LO T670, LY T670, LG T670, LP T670 LSG T670, LSP T670, LSY T670, LOP T670, LYG T670 LG T671, LOG T671, LSG T671 LB T673, LV T673, LT T673, LW T673 LH T674 LS T676, LA T676, LO T676, LY T676, LB T676, LH T676, LSB T676, LW T676 LB T67C, LV T67C, LT T67C, LS T67K, LO T67K, LY T67K, LW E67C LS E67B, LA E67B, LO E67B, LY E67B, LB E67C, LV E67C, LT E67C LW T67C LS T679, LY T679, LG T679 LS T770, LO T770, LY T770, LG T770, LP T770 LB T773, LV T773, LT T773, LW T773 LH T774 LS E675, LA E675, LY E675, LS T675 LS T776, LA T776, LO T776, LY T776, LB T776 LHGB T686 LT T68C, LB T68C - Hyper Mini TOPLED® LB M676 - Mini TOPLED Santana® LG M470 LS M47K, LO M47K, LY M47K Source: http://www.osram.convergy.de LUXEON: - LUMILED® LXK2-PW12-R00, LXK2-PW12-S00, LXK2-PW14-U00, LXK2-PW14-V00 LXK2-PM12-R00, LXK2-PM12-S00, LXK2-PM14-U00 LXK2-PE12-Q00, LXK2-PE12-R00, LXK2-PE12-S00, LXK2-PE14-T00, LXK2-PE14-U00 LXK2-PB12-K00, LXK2-PB12-L00, LXK2-PB12-M00, LXK2-PB14-N00, LXK2-PB14-P00, LXK2-PB14-Q00 LXK2-PR12-L00, LXK2-PR12-M00, LXK2-PR14-Q00, LXK2-PR14-R00 LXK2-PD12-Q00, LXK2-PD12-R00, LXK2-PD12-S00 LXK2-PH12-R00, LXK2-PH12-S00 LXK2-PL12-P00, LXK2-PL12-Q00, LXK2-PL12-R00 Source: www.luxeon.com KINGBRIGHT: KA-3528ASYC Source: www.kingbright.com; PARTNO: LTST-C150KGKT
D11 = led-7-segment:LA-401*D: Single Digit LED Numeric Display (anode common) Source: ROHM .. la-1401dn.pdf; PARTNO: LA-401AD
F1 = BMSafeMasterIO:467; PARTNO: 0467.250NR
IC1 = freescale:MC9S12XF-144: MC9S12XF512 Source: www.freescale.com .. MC9S12XF512V1RM.pdf; MPN: LFDAS12XFLT; OC_FARNELL: unknown; OC_NEWARK: 14M5920; PARTNO: MC9S12XDP512MAG
IC2 = ftdichip:FT232R: Source: http://www.ftdichip.com/Documents/DataSheets/DS_FT232R_v104.pdf; PARTNO: FT232RL
IC3 = adum1201:ADUM1201; PARTNO: ADUM1201WTRZ
IC4 IC5 IC9 IC10 = BMSafeMasterIO:SDM10M45SD; PARTNO: SDM10M45SD-7-F
IC6 IC8 = ELE4000_BMS:TJA1040; PARTNO: TJA1040
IC7 IC11 = SparkFun:ILD213T; PARTNO: ILD213T
IC12 IC13 = BMSafeMasterIO:CM1213-08MR; PARTNO: CM1213-08MR
IC14 = Watchdog:WATCHDOG; PARTNO: UCC2946D
IC15 IC16 = sn74hc08:SN74HC08: Quad And gate sn74hc08-q1; PARTNO: SN74HC08QPWRQ1
IC17 = DCP0105:DCP0115: DC/DC Converters Miniature 15V Input, 1W Isolated Unregulated; DNP: T; PARTNO: DCP010505BP-U
IC18 = PTN78000W:DCDCMAITRE_HOLES; PARTNO: PTN78000WAH
JP1 = jumper:JP3Q: JUMPER; PARTNO: 67996-206HLF
JP2-JP5 = SparkFun:STAND-OFF: Stand Off This is the mechanical footprint for a #4 phillips button head screw. Use the keepout ring to avoid running the screw head into surrounding components. SKU : PRT-00447; BOM: EXCLUDE
JP6 JP7 JP9 JP11 = jumper:JP1E: JUMPER; DNP: T; PARTNO: 68001-202HLF
JP8 = jumper:JP5Q: JUMPER; DNP: T; PARTNO: 68602-110HLF
JP10 = jumper:JP2E: JUMPER; DNP: T; PARTNO: 68000-103HLF
L1 = rcl:MYDEVICE: MI0805K400R-10 Ferrite bead; PARTNO: MI0805K400R-10
Q1 Q3-Q7 = transistor-power:IRLR014; PARTNO: IRLR014TRPBF
Q2 = ELE4000_BMS:CSM-7X; PARTNO: ECS-160-18-5PXEN-TR
R1 R2 = rcl:R-EU_: RESISTOR, European symbol; PARTNO: MCR10EZHF4750
R3 R4 R31 R32 = rcl:R-US_: RESISTOR, American symbol; PARTNO: MCR18EZPF60R4
R5 R6 R9 R14-R17 R21 = rcl:R-EU_: RESISTOR, European symbol; PARTNO: RC0805JR-0710KL
R7 R8 = rcl:R-US_: RESISTOR, American symbol; PARTNO: MCR10EZPJ105
R10 R11 = rcl:R-US_: RESISTOR, American symbol; PARTNO: MCR10EZHJ104
R12 = rcl:R-US_: RESISTOR, American symbol; PARTNO: RR1220P-2102-D-M
R13 = rcl:R-US_: RESISTOR, American symbol; PARTNO: MCR10EZHF4750
R18 R22 R46 R49 R52 R55 R58 = resistor:R-US_: RESISTOR, American symbol; PARTNO: RC0805JR-0710KL
R19 R23 R47 R50 R53 R56 R59 = resistor:R-US_: RESISTOR, American symbol; DNP: T; PARTNO: RC0805JR-0710KL
R20 R24 R48 R51 R54 R57 R60 = resistor:R-US_: RESISTOR, American symbol; PARTNO: RC0805FR-072K43L
R25-R27 R36-R42 = rcl:R-US_: RESISTOR, American symbol; PARTNO: RC0805JR-0710KL
R28-R30 R33-R35 = rcl:R-US_: RESISTOR, American symbol; PARTNO: RC0805JR-071KL
R43 = rcl:R-US_: RESISTOR, American symbol; DNP: T; PARTNO: RMCF0805ZT0R00
R44 R45 = rcl:R-US_: RESISTOR, American symbol; PARTNO: RMCF0805JT4K70
R61-R68 = rcl:R-US_: RESISTOR, American symbol
S1 S2 = ELE4000_BMS:SWITCH_DPDT; PARTNO: JS202011SCQN
SV1 = jumper:JP3Q: JUMPER; DNP: T; PARTNO: 67996-206HLF
X1 X3 X5 X6 = con-tycoelectronics:RJ11: CORCOM Modular RJ Jacks No Shield Source: www.tycoelectronics.com .. ENG_DS_1654001_1099_RJ_L_0507.pdf; PARTNO: 5555165-1
X2 = con_tyco_eurostyle:282836-6: Tyco 282836-6; PARTNO: 282836-6
X4 = con_tyco_eurostyle:1-282836-2: Tyco Eurostyle 1-282236-2 Terminal Block 12POS; PARTNO: 1-282836-2
X7 = SparkFun:USB: USB Connectors USB-B-PTH is fully proven SKU : PRT-00139 USB-miniB is fully proven SKU : PRT-00587 USB-A-PCB is untested. USB-A-H is throughly reviewed, but untested. Spark Fun Electronics SKU : PRT-00437 USB-B-SMT is throughly reviewed, but untested. Needs silkscreen touching up. USB-A-S has not been used/tested USB-MB-H has not been used/tested; PARTNO: 292304-1
X8 = con_tyco_eurostyle:282836-2: TYCO 282836-2 TERM BLOCK 2POS SIDE ENTRY 5MM EURISTYLE; DNP: T; PARTNO: 282836-2
X9 = con_tyco_eurostyle:282836-8: Tyco 282836-8 Eurostyle Terminal Block Connector. TERM BLOCK 8POS SIDE ENTRY 5MM Digikey:; PARTNO: 282836-8